# Altium schematic sheet MOSFET.SchDoc
size A4
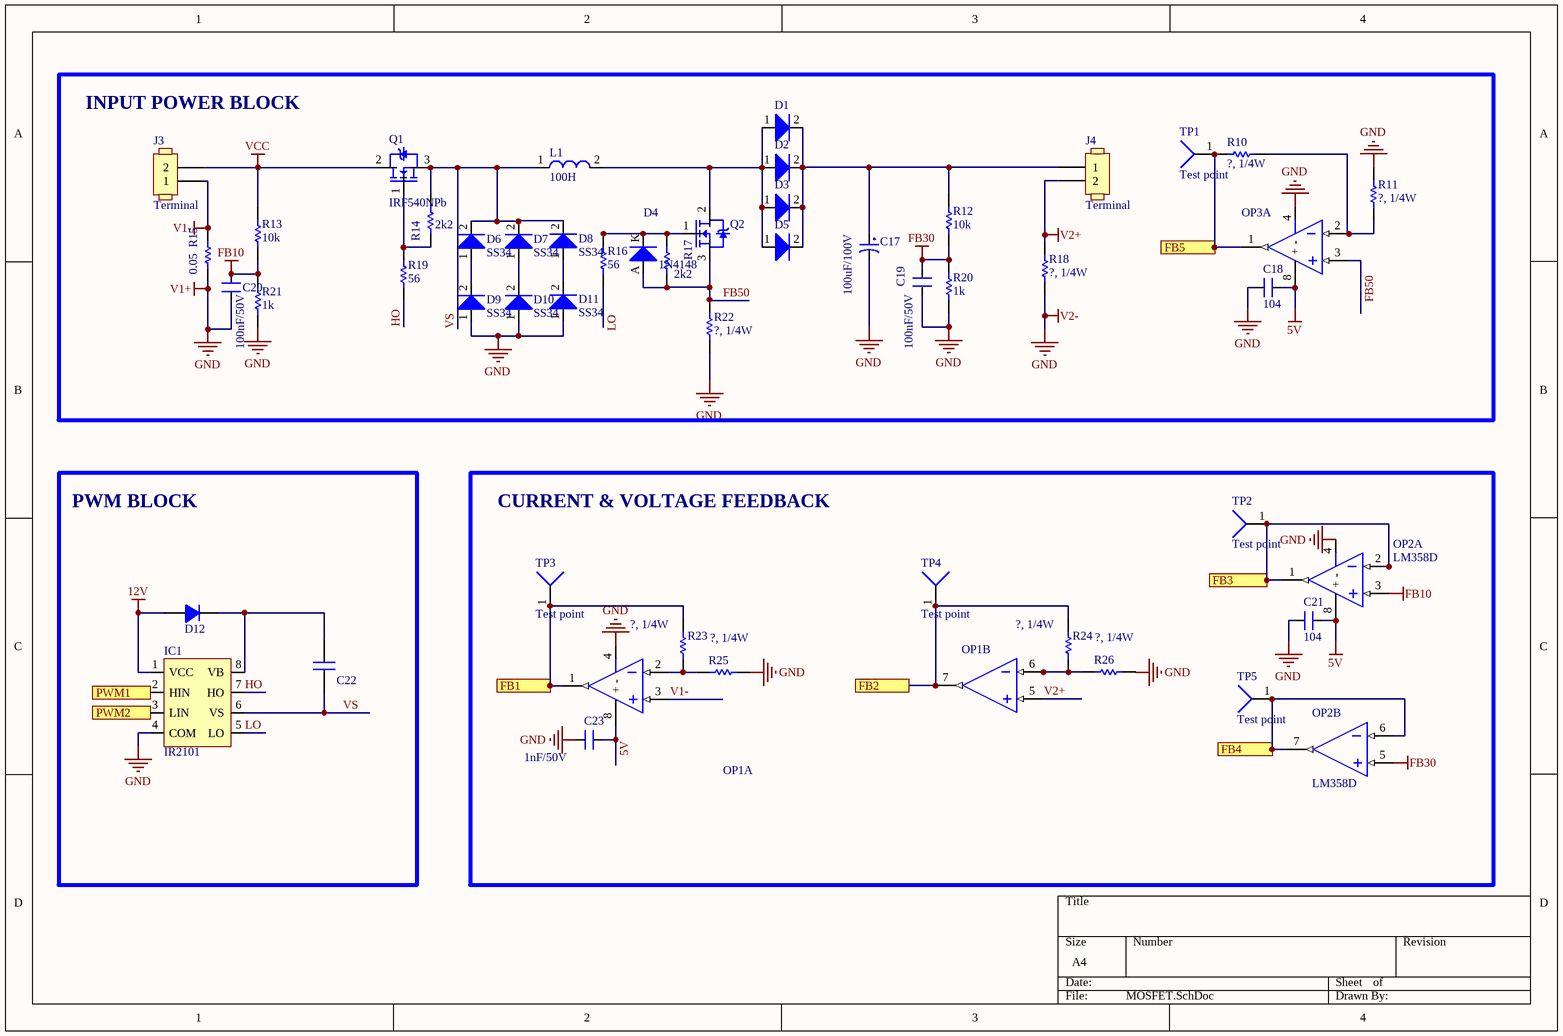
[diagram p0: MOSFET.SchDoc]

## Parts
C17  100uF/100V  [CAP_xUF_50V_TH_10x16 HORIZONTAL]
C18  104  [CAP 0603(1508)]
C19  100nF/50V  [CAP 0603(1508)]
C20  100nF/50V  [CAP 0603(1508)]
C21  104  [CAP 0603(1508)]
C22  C1210  [CAPACITOR-SMD-1210 (3225)]  (value not drawn)
C23  1nF/50V  [CAP 0603(1508)]
D1  UF4007  [DO204SMDDUAL]  (value not drawn)
D2  UF4007  [DO204SMDDUAL]  (value not drawn)
D3  UF4007  [DO204SMDDUAL]  (value not drawn)
D4  1N4148  [LL34]
D5  UF4007  [DO204SMDDUAL]  (value not drawn)
D6  SS34  [SS34]
D7  SS34  [SS34]
D8  SS34  [SS34]
D9  SS34  [SS34]
D10  SS34  [SS34]
D11  SS34  [SS34]
D12  UF4007  [DO-41-10mm]  (value not drawn)
IC1  IR2101  [IR2101]
J3  Terminal  [Terminal x2 5mm]
J4  Terminal  [Terminal x2 5mm]
L1  100H  [INDUCTOR 5A LIE]
OP1  LM358D  [SOIC8_600]  (value not drawn)  (parts A,B of 2)
OP2  LM358D  [SOIC8_600]  (parts A,B of 2)
OP3  LM358D  [SOIC8_600]  (value not drawn)  (part A of 2)
Q1  IRF540NPb  [IRF540NPBF HORIZONTAL]
Q2  IRF540NPb  [IRF540NPBF HORIZONTAL]  (value not drawn)
R10  ?, 1/4W  [RES 0603(1508)]
R11  ?, 1/4W  [RES 0603(1508)]
R12  10k  [RES 0603(1508)]
R13  10k  [RES 0603(1508)]
R14  2k2  [RES 0603(1508)]
R15  0.05  [RES 2512(6332)]
R16  56  [RES 0603(1508)]
R17  2k2  [RES 0603(1508)]
R18  ?, 1/4W  [RES 2512(6332)]
R19  56  [RES 0603(1508)]
R20  1k  [RES 0603(1508)]
R21  1k  [RES 0603(1508)]
R22  ?, 1/4W  [RES 2512(6332)]
R23  ?, 1/4W  [RES 0603(1508)]
R24  ?, 1/4W  [RES 0603(1508)]
R25  ?, 1/4W  [RES 0603(1508)]
R26  ?, 1/4W  [RES 0603(1508)]
TP1  Test point  [Test_point_VIA06]
TP2  Test point  [Test_point_VIA06]
TP3  Test point  [Test_point_VIA06]
TP4  Test point  [Test_point_VIA06]
TP5  Test point  [Test_point_VIA06]

## Blocks framed on the sheet
INPUT POWER BLOCK: C17-C20 D1-D11 J3 J4 L1 OP3 Q1 Q2 R10-R22 TP1
PWM BLOCK: C22 D12 IC1
CURRENT & VOLTAGE FEEDBACK: C21 C23 OP1 OP2 R23-R26 TP2-TP5

## Ports
FB1, FB2, FB3, FB4, FB5, PWM1, PWM2

## Nets
5V: C18.1 C21.1 C23.1 OP1.8(+) OP2.8(+) OP3.8(+)
12V: D12.1(A) IC1.1(VCC)
FB10: C20.2 OP2.3(IN+) R13.2 R21.1
FB30: C19.2 OP2.5(IN+) R12.2 R20.1
GND: C17.2 C18.2 C19.1 C20.1 C21.2 C23.2 D9.1(A) D10.1(A) D11.1(A) IC1.4(COM) OP1.4(-) OP2.4(-) OP3.4(-) R11.1 R15.2 R18.1 R20.2 R21.2 R22.2 R25.1 R26.1  [also labelled V1+, V2-]
V1-: J3.1 OP1.3(IN+) R15.1
V2+: J4.2 OP1.5(IN+) R18.2
VCC: J3.2 Q1.2(D) R13.1
FB1: OP1.1(OUT) R23.1 TP3.1 ; port FB1
FB2: OP1.7(OUT2) R24.1 TP4.1 ; port FB2
FB3: OP2.1(OUT) OP2.2(IN-) TP2.1 ; port FB3
FB4: OP2.6(IN-) OP2.7(OUT2) TP5.1 ; port FB4
FB5: OP3.1(OUT) R10.2 TP1.1 ; port FB5
FB50: D4.A OP3.3(IN+) Q2.3(S) R17.2 R22.1
HO: IC1.7(HO) R19.2
LO: IC1.5(LO) R16.2
PWM1: IC1.2(HIN) ; port PWM1
PWM2: IC1.3(LIN) ; port PWM2
VS: C22.1 D6.2(K) D7.2(K) D8.2(K) IC1.6(VS) L1.1 Q1.3(S) R14.1
NetC17_1: C17.1 D1.2(K) D2.2(K) D3.2(K) D5.2(K) J4.1 R12.1
NetC22_2: C22.2 D12.2(K) IC1.8(VB)
NetD1_1: D1.1(A) D2.1(A) D3.1(A) D5.1(A) L1.2 Q2.2(D)
NetD4_K: D4.K Q2.1 R16.1 R17.1
NetD6_1: D6.1(A) D9.2(K)
NetD7_1: D7.1(A) D10.2(K)
NetD8_1: D8.1(A) D11.2(K)
NetOP1_2: OP1.2(IN-) R23.2 R25.2
NetOP1_6: OP1.6(IN-) R24.2 R26.2
NetOP3_2: OP3.2(IN-) R10.1 R11.2
NetQ1_1: Q1.1 R14.2 R19.1

## Library data of the parts
C17 = CAP_ALU/CHE_100uF_100V_POL_10x16
C18 C21 C23 = CAP_CER_1nF_50V_NPOL: Ceramic Capacitor 1nF/50V (+-20% TH)/(+10%SMD)
C19 C20 = CAP_CER_100nF_50V_NPOL: Ceramic Capacitor 100nF/50V (+-20% TH)/(+10%SMD)
C22 = C1210: Tụ dán không phân cực 1210
D12 = Diode 1000V 1A
J3 J4 = Terminal x2
L1 = Inductor
R10-R26 = Resistor 1/4W: Resistor through hole 1/4W